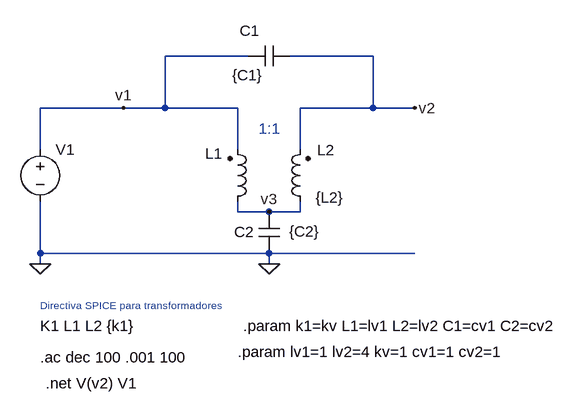
[diagram p0: schematic trafo_real_mna.asc]
trafo_real_mna.asc, the LTspice schematic file:
Version 4
SHEET 1 880 1328
WIRE 320 384 192 384
WIRE 512 384 384 384
WIRE 128 464 0 464
WIRE 192 464 192 384
WIRE 192 464 128 464
WIRE 304 464 192 464
WIRE 512 464 512 384
WIRE 512 464 400 464
WIRE 576 464 512 464
WIRE 0 528 0 464
WIRE 304 528 304 464
WIRE 400 528 400 464
WIRE 304 624 304 608
WIRE 352 624 304 624
WIRE 400 624 400 608
WIRE 400 624 352 624
WIRE 0 688 0 608
WIRE 352 688 0 688
WIRE 576 688 352 688
WIRE 0 704 0 688
WIRE 352 704 352 688
FLAG 0 704 0
FLAG 128 464 v1
FLAG 576 464 v2
FLAG 352 704 0
FLAG 352 624 v3
SYMBOL voltage 0 512 R0
WINDOW 3 24 96 Invisible 2
SYMATTR Value 0
SYMATTR InstName V1
SYMATTR Value2 AC 1 0
SYMATTR SpiceLine Rser=0
SYMBOL ind2 288 624 M180
WINDOW 0 -34 90 Left 2
WINDOW 3 -24 44 Invisible 2
SYMATTR InstName L1
SYMATTR Value {L1}
SYMATTR Type ind
SYMATTR SpiceLine Rser=0
SYMBOL ind2 416 624 R180
WINDOW 0 -37 95 Left 2
WINDOW 3 -51 22 Left 2
SYMATTR InstName L2
SYMATTR Value {L2}
SYMATTR Type ind
SYMATTR SpiceLine Rser=0
SYMBOL cap 336 624 R0
WINDOW 0 -38 31 Left 2
WINDOW 3 47 30 Left 2
SYMATTR InstName C2
SYMATTR Value {C2}
SYMBOL cap 384 368 R90
WINDOW 0 -7 62 VBottom 2
WINDOW 3 30 65 VTop 2
SYMATTR InstName C1
SYMATTR Value {C1}
TEXT 0 800 Left 2 !K1 L1 L2 {k1}
TEXT 336 496 Left 2 ;1:1
TEXT 0 768 Left 1 ;Directiva SPICE para transformadores
TEXT 312 800 Left 2 !.param k1=kv L1=lv1 L2=lv2 C1=cv1 C2=cv2
TEXT 8 888 Left 2 !.net V(v2) V1
TEXT 0 848 Left 2 !.ac dec 100 .001 100
TEXT 304 840 Left 2 !.param lv1=1 lv2=4 kv=1 cv1=1 cv2=1

The netlist it stands for:
* trafo_real_mna.asc
V1 v1 0 0 AC 1 0 Rser=0
L1 v3 v1 {L1} Rser=0
L2 v3 v2 {L2} Rser=0
C2 v3 0 {C2}
C1 v2 v1 {C1}
K1 L1 L2 {k1}
* 1:1
* Directiva SPICE para transformadores
.param k1=kv L1=lv1 L2=lv2 C1=cv1 C2=cv2
.net V(v2) V1
.ac dec 100 .001 100
.param lv1=1 lv2=4 kv=1 cv1=1 cv2=1
.backanno
.end